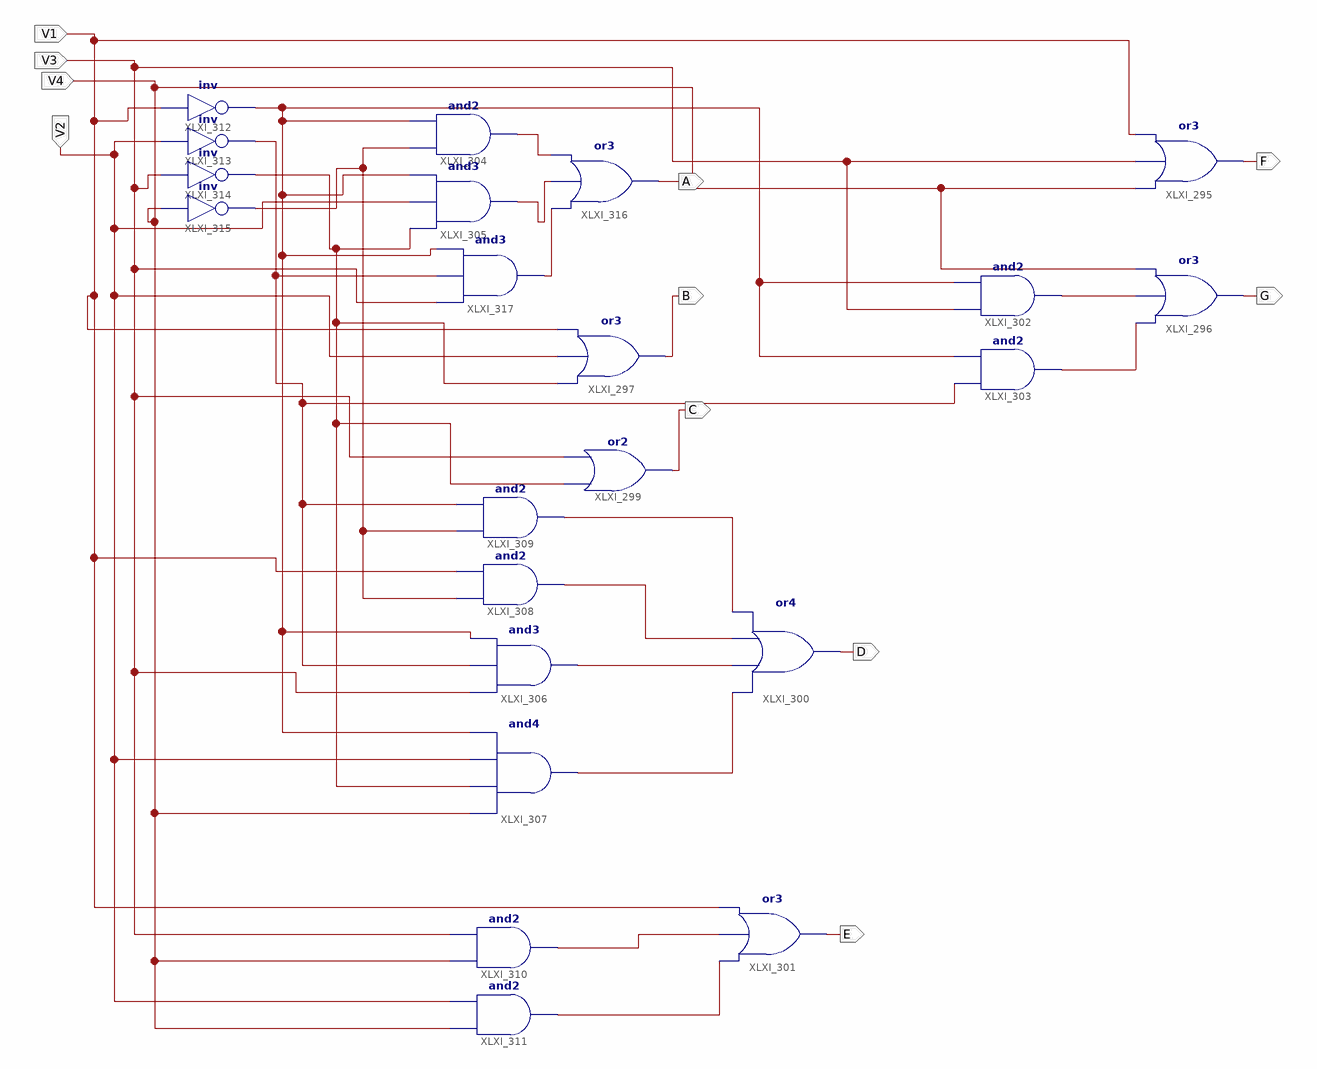
[diagram p0: schematic sheet 1]
// Xilinx ISE schematic Schematic2.sch (spartan6) as structural Verilog: 22 symbols, 11 ports
module Schematic2 (
  input  V1,
  input  V2,
  input  V3,
  input  V4,
  output A,
  output B,
  output C,
  output D,
  output E,
  output F,
  output G
);

  wire XLXN_292, XLXN_295, XLXN_296, XLXN_297, XLXN_299, XLXN_300, XLXN_301, XLXN_302, XLXN_303, XLXN_317,
       XLXN_320, XLXN_321, XLXN_323, XLXN_338, XLXN_339;

  or XLXI_295 (F, V4, V3, V1);
  or XLXI_296 (G, XLXN_296, XLXN_295, V4);
  or XLXI_297 (B, XLXN_320, V2, V1);
  or XLXI_299 (C, XLXN_320, V3);
  or XLXI_300 (D, XLXN_301, XLXN_300, XLXN_299, XLXN_297);
  or XLXI_301 (E, XLXN_303, XLXN_302, V1);
  and XLXI_302 (XLXN_295, V3, XLXN_323);
  and XLXI_303 (XLXN_296, XLXN_317, XLXN_323);
  and XLXI_306 (XLXN_300, V3, XLXN_317, XLXN_323);
  and XLXI_307 (XLXN_301, V4, XLXN_320, V2, XLXN_323);
  and XLXI_308 (XLXN_299, XLXN_321, V1);
  and XLXI_309 (XLXN_297, XLXN_321, XLXN_317);
  and XLXI_310 (XLXN_302, V4, V3);
  and XLXI_311 (XLXN_303, V4, V2);
  and XLXI_304 (XLXN_292, XLXN_321, XLXN_323);
  and XLXI_305 (XLXN_338, XLXN_320, V2, XLXN_323);
  not XLXI_312 (XLXN_323, V1);
  not XLXI_313 (XLXN_317, V2);
  not XLXI_314 (XLXN_320, V3);
  not XLXI_315 (XLXN_321, V4);
  or XLXI_316 (A, XLXN_339, XLXN_338, XLXN_292);
  and XLXI_317 (XLXN_339, V3, XLXN_317, XLXN_323);
endmodule
